# Altium schematic sheet CCE_Magic_Wand_01.SchDoc
size A4; SheetNumber: 1; SheetTotal: 1
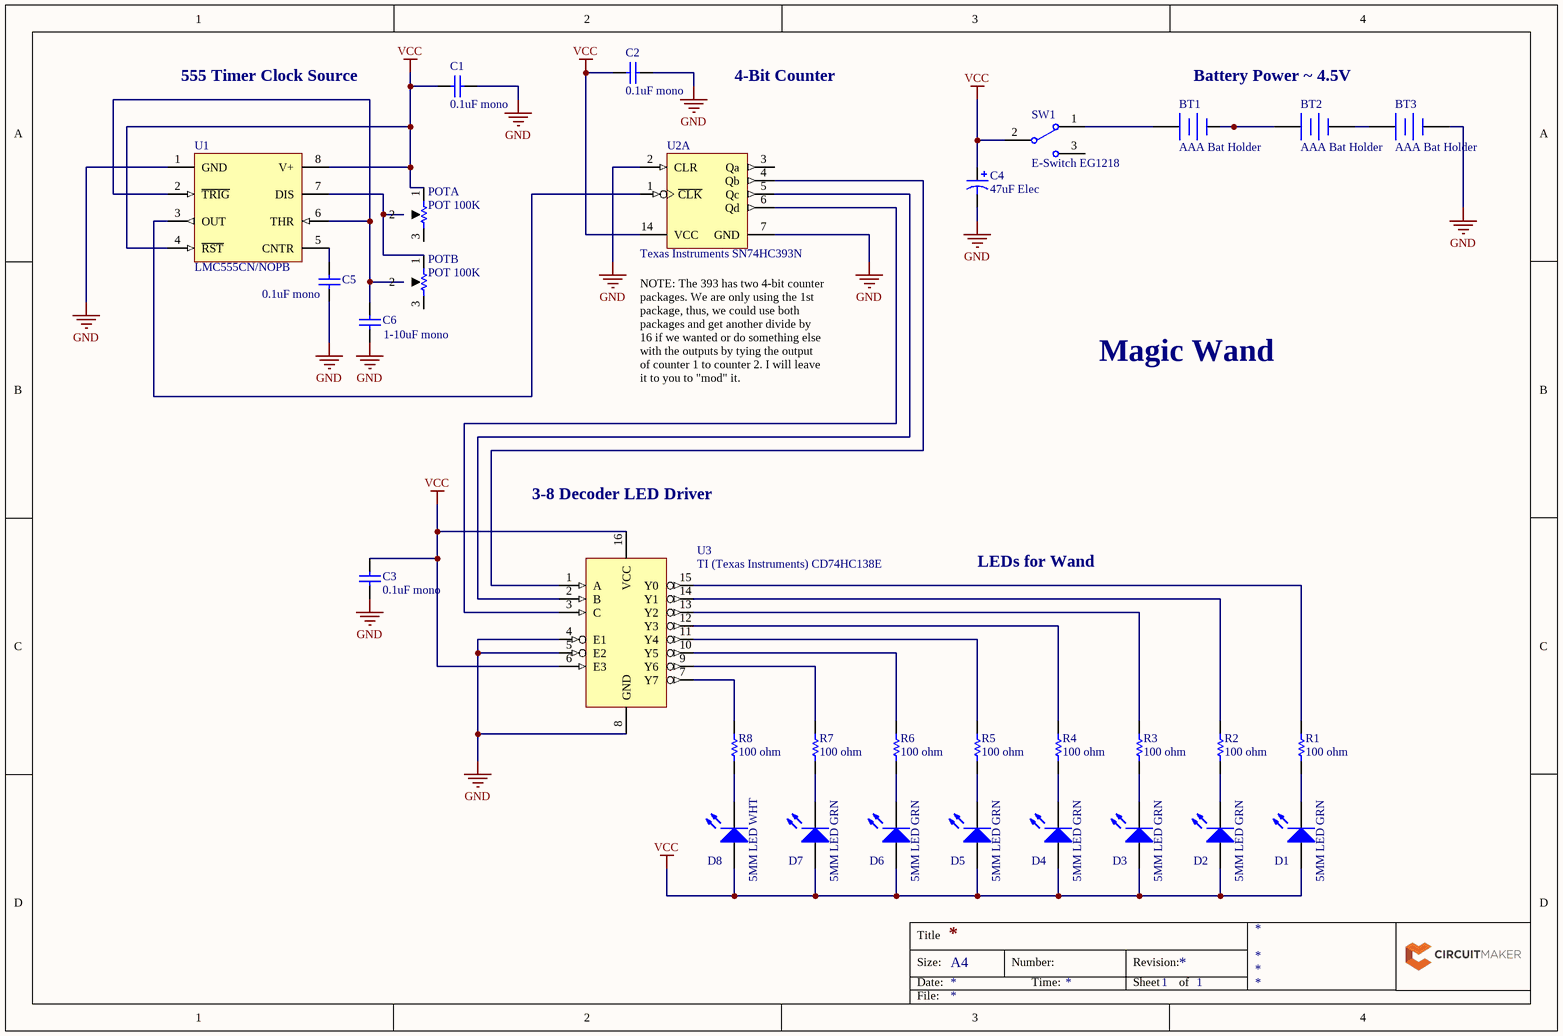
[diagram p0: CCE_Magic_Wand_01.SchDoc]

## Parts
BT1  AAA Bat Holder  [PCB-3612-1]
BT2  AAA Bat Holder  [PCB-3612-1]
BT3  AAA Bat Holder  [PCB-3612-1]
C1  0.1uF mono  [PCB-l4zci1ynknckpo24ombh-1]
C2  0.1uF mono  [PCB-l4zci1ynknckpo24ombh-1]
C3  0.1uF mono  [PCB-l4zci1ynknckpo24ombh-1]
C4  47uF Elec  [PCB-xswzn1jk2ejoevwvaoxh-1]
C5  0.1uF mono  [PCB-l4zci1ynknckpo24ombh-1]
C6  1-10uF mono  [PCB-l4zci1ynknckpo24ombh-1]
D1  5MM LED GRN  [PCB-b5vk7vz0xhkw7l0fnova-1]
D2  5MM LED GRN  [PCB-b5vk7vz0xhkw7l0fnova-1]
D3  5MM LED GRN  [PCB-b5vk7vz0xhkw7l0fnova-1]
D4  5MM LED GRN  [PCB-b5vk7vz0xhkw7l0fnova-1]
D5  5MM LED GRN  [PCB-b5vk7vz0xhkw7l0fnova-1]
D6  5MM LED GRN  [PCB-b5vk7vz0xhkw7l0fnova-1]
D7  5MM LED GRN  [PCB-b5vk7vz0xhkw7l0fnova-1]
D8  5MM LED WHT  [PCB-b5vk7vz0xhkw7l0fnova-1]
POTA  POT 100K  [PCB-j5qmepyewn2098kwld9k-1]
POTB  POT 100K  [PCB-j5qmepyewn2098kwld9k-1]
R1  100 ohm  [PCB-bfjjg625tt0lscyu35rt-1]
R2  100 ohm  [PCB-bfjjg625tt0lscyu35rt-1]
R3  100 ohm  [PCB-bfjjg625tt0lscyu35rt-1]
R4  100 ohm  [PCB-bfjjg625tt0lscyu35rt-1]
R5  100 ohm  [PCB-bfjjg625tt0lscyu35rt-1]
R6  100 ohm  [PCB-bfjjg625tt0lscyu35rt-1]
R7  100 ohm  [PCB-bfjjg625tt0lscyu35rt-1]
R8  100 ohm  [PCB-bfjjg625tt0lscyu35rt-1]
SW1  E-Switch EG1218  [ESWI-EG1218_V]
U1  LMC555CN/NOPB  [N08E]
U2  Texas Instruments SN74HC393N  [PCB-84al2o76zfufqnpnnbbm-1]  (part A of 2)
U3  TI (Texas Instruments) CD74HC138E  [PCB-1166716-1]

## Nets
GND: BT3.2(-) C1.2 C2.2 C3.2 C4.- C5.1 C6.1 U1.1(GND) U2.2(CLR) U2.7(GND) U3.4(E1) U3.5(E2) U3.8(GND)
VCC: C1.1 C2.1 C3.1 C4.+ D1.2(A) D2.2(A) D3.2(A) D4.2(A) D5.2(A) D6.2(A) D7.2(A) D8.2(A) POTA.1 SW1.2(COM) U1.4(~{RST}) U1.8(V+) U2.14(VCC) U3.6(E3) U3.16(VCC)
NetBT1_1: BT1.1(+) SW1.1
NetBT1_2: BT1.2(-) BT2.1(+)
NetBT2_2: BT2.2(-) BT3.1(+)
NetC5_2: C5.2 U1.5(CNTR)
NetC6_2: C6.2 POTB.2 U1.2(~{TRIG}) U1.6(THR)
NetD1_1: D1.1(K) R1.2
NetD2_1: D2.1(K) R2.2
NetD3_1: D3.1(K) R3.2
NetD4_1: D4.1(K) R4.2
NetD5_1: D5.1(K) R5.2
NetD6_1: D6.1(K) R6.2
NetD7_1: D7.1(K) R7.2
NetD8_1: D8.1(K) R8.2
NetPOTA_2: POTA.2 POTB.1 U1.7(DIS)
NetR1_1: R1.1 U3.15(Y0)
NetR2_1: R2.1 U3.14(Y1)
NetR3_1: R3.1 U3.13(Y2)
NetR4_1: R4.1 U3.12(Y3)
NetR5_1: R5.1 U3.11(Y4)
NetR6_1: R6.1 U3.10(Y5)
NetR7_1: R7.1 U3.9(Y6)
NetR8_1: R8.1 U3.7(Y7)
NetU1_3: U1.3(OUT) U2.1(~{CLK})
NetU2_4: U2.4(Qb) U3.1(A)
NetU2_5: U2.5(Qc) U3.2(B)
NetU2_6: U2.6(Qd) U3.3(C)

Not connected (* = marked no-connect by the designer): POTA 3; POTB 3; SW1 3; U2 3(Qa)

## Notes on the sheet
- 555 Timer Clock Source
- 4-Bit Counter
- Battery Power ~ 4.5V
- (near U2) NOTE: The 393 has two 4-bit counter
  packages. We are only using the 1st
  package, thus, we could use both
  packages and get another divide by
  16 if we wanted or do something else
  with the outputs by tying the output
  of counter 1 to counter 2. I will leave
  it to you to "mod" it.
- Magic Wand
- 3-8 Decoder LED Driver
- LEDs for Wand
- Title
- Size:
- Date:
- A4
- Number:
- Time:
- Revision:
- Sheet
- of
- File:

## Library data of the parts
BT1-BT3 = CMP-3612-5: HOLDER BATTERY 1CELL AAA PC MNT; Lead-Free Status: Lead Free; Octopart Url: https://octopart.com/2466-keystone-65856; REACH SVHC Compliance: No SVHC; RoHS: Compliant; OctopartID: fe0e3705da2821c9; Packaging: Bag; Material: Plastic; Contact Plating: Nickel
C1-C3 C5 C6 = K104Z15Y5VF5TL2: Capacitor; Ceramic; Cap 0.1 uF; Tol -20, +80%; Vol-Rtg 50 VDC; Radial; Y5V; Tape & Reel; Capacitance: 100 nF; Lead-Free Status: Contains Lead; Voltage Rating (DC): 50.0 V; Lead Length: 30.0 mm; Capacitance Tolerance: +80/-20%; Manufacturer Part Number: K104Z15Y5VF5TL2; Dielectric Material: Ceramic; Number of Pins: 2; Size-Width: 4.00 mm; Dielectric Characteristic: Y5V; Size-Thickness: 2.60 mm; Size-Height: 4.00 mm; Size-Diameter: 500 µm; Packaging: Cut Tape (CT), Tape & Reel (TR); OctopartID: 7d20b42952c2a2e7; Octopart URL: http://octopart.com/k104z15y5vf5tl2-vishay+bccomponents-199300; Mounting Style: Through Hole; Size-Length: 4.00 mm; RoHS: Compliant
C4 = EEA-GA1C100H: Electrolytic capacitor Radial lead 2.5 mm 10 µF 16 V 20 % (Ø) 4 mm Panasonic EEA-GA1C100H 1 pc(s); Capacitance Tolerance: ±20%; Capacitance: 10 uF; Voltage Rating (DC): 16.0 V; OctopartID: b868704b0d3c67af; RoHS: Compliant; Octopart URL: http://octopart.com/eea-ga1c100h-panasonic-19501106; Size-Diameter: 4.00 mm; Lifecycle Status: Not Listed by Manufacturer; Size-Height: 7.00 mm; Dimension: DxLxF = 4x7x2.5mm; Digikey PN: P15787CT-ND; Digikey URL: http://www.digikey.com/product-detail/en/panasonic-electronic-components/EEA-GA1C100H/P15787CT-ND/3831154; Manufacturer Part Number: EEA-GA1C100H
D1-D8 = CMP-92bb5b2eff764d7c-3: LED Uni-Color Green 2-Pin T-1 3/4 Bulk; Manufacturer Part Number: C503B-GCN-CY0C0791; Manufacturer: Cree; Wavelength: 527 nm; Luminous Intensity: 12.5 cd; Viewing Angle: 30 °; Forward Voltage: 3.20 V; Octopart URL: http://octopart.com/c503b-gcn-cy0c0791-cree-10438827; OctopartID: 92bb5b2eff764d7c; RoHS: Compliant; Color: Green; Mounting Style: Through Hole; Number of Pins: 2
POTA POTB = CMP-0fb4c6b6e673d073-3: Res Cermet Trimmer 10K Ohm 10% 1/2W 1(Elec)/1(Mech)Turn 2.6mm (7 X 7 X 5.8mm) Pin Thru-Hole Bulk; Manufacturer Part Number: CT6EP103; Power Rating: 0.5 W; Lead-Free Status: Lead Free; Resistance: 10000.0 Ω; Octopart URL: http://octopart.com/ct6ep103-copal-576673; Size-Length: 0.007 m; Packaging: Bulk; OctopartID: 0fb4c6b6e673d073; Size-Width: 0.007 m; Weight: 0.51 g; Size-Height: 0.0058 m; Color: Blue; Resistance Tolerance: ±10%; RoHS: Compliant; Mounting Style: Through Hole
R1-R8 = CMP-db3e1311f37e04f9-1: Res Carbon Film 1K Ohm 5% 1/4W -400ppm/°C to 0ppm/°C Conformal AXL Thru-Hole T/R; Manufacturer Part Number: CF14JT1K00; Lead-Free Status: Lead Free; Octopart URL: http://octopart.com/cf14jt1k00-stackpole+electronics-19205414; Packaging: Tape & Reel (TR); Resistance Tolerance: ±5%; RoHS: Compliant; Mounting Style: Axial, Through Hole; OctopartID: db3e1311f37e04f9
SW1 = EG1218: Slide Switch, 500 V, -20 to 70 degC, 3-Pin THD, RoHS; Lead-Free Status: Lead Free; Contacts Type: SPDT; Actuator Type: Standard; Current Rating: 200 mA; Number of Positions: 2; Contact Material: Copper Alloy; Octopart Url: http://octopart.com/eg1218-e-switch-1056201; DatasheetVersion: Oct-15; Size-Width: 4.00 mm; Manufacturer Part Number: EG1218; Size-Height: 5.40 mm; Packaging: Bulk; PackageReference: EG1218; Orientation: Vertical; RoHS: Compliant; Mounting Style: PCB, Through Hole; Size-Length: 2.03 mm; Seller Landing  Url: https://octopart-clicks.com/click/track?country=US&ak=8157f166&sig=0e9adab&sid=459&ppid=1056201&vpid=1179261&ct=offers; PackageDescription: 3-Pin Through Hole Device, Body 11.6 x 4 mm, Pitch 2.5 mm; OctopartID: 9a5a5340a2f5459d; Contact Plating: Silver
U1 = LMC555CN/NOPB: CMOS Timer, 8-pin MDIP, Pb-Free; Frequency: 3000000.0 Hz; Lead-Free Status: Lead Free; Quiescent Current: 5e-05 A; RoHS: Compliant; Lifecycle Status: Active; OctopartID: 3409fc79b713ebce; Octopart Url: https://octopart.com/lmc555cn%2Fnopb-texas+instruments-24815228; Number of Pins: 8; Packaging: Tube; Mounting Style: Through Hole
U2 = SN74HC393N: Counter/Divider Dual 4-Bit Binary UP 14-Pin PDIP Tube; Number of Elements: 2; Clock Speed: 60.0 MHz; Number of Bits: 4; Output Current Drive: -1.00 mA; Supply Voltage (DC): 2.00 V to 6.00 V; Lead-Free Status: Lead Free; Voltage Nodes: 6.00 V, 5.00 V, 2.00 V; Lifecycle Status: Active; Octopart URL: http://octopart.com/sn74hc393n-texas+instruments-30818; RoHS: Compliant; REACH SVHC Compliance: No SVHC; Manufacturer Part Number: SN74HC393N; Case/Package: DIP; OctopartID: 3c53f5596157e394; Number of Pins: 14; Mounting Style: Through Hole; Packaging: Tube
U3 = CD74HC138E: TEXAS INSTRUMENTS   CD74HC138E   Logic Type:Decoder / Demultiplexer; Lead-Free Status: Lead Free; Propagation Delay: 265 ns; Number of Bits: 8; Output Current: 5.2 mA; Number of Circuits: 1; Operating Supply Voltage: 2 V to 6 V; Operating Supply Voltage (typical): 2.5V / 3.3V / 5.0V; Mounting Style: Through Hole; Packaging: Tube; Octopart Url: https://octopart.com/cd74hc138e-harris-4046706; Manufacturer Part Number: CD74HC138E; Number of Pins: 16; Operating Temperature: -55C to 125C; Manufacturer: Texas Instruments; Package: PDIP; Lifecycle Status: Active; REACH SVHC Compliance: No SVHC; OctopartID: 2c46e54acdf8f381; Number of Outputs: 8; RoHS: Compliant